# Altium schematic sheet LED4.SchDoc
size A4
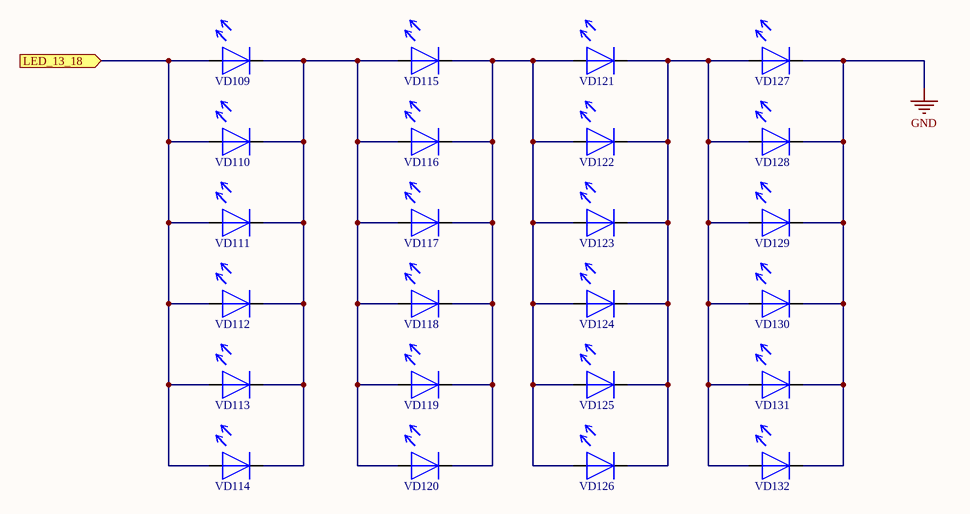
[diagram p0: LED4.SchDoc]

## Parts
VD109  SPMWHT541MD5WAT0SB  [LED_Samsung]  (value not drawn)
VD110  SPMWHT541MD5WAT0SB  [LED_Samsung]  (value not drawn)
VD111  SPMWHT541MD5WAT0SB  [LED_Samsung]  (value not drawn)
VD112  SPMWHT541MD5WAT0SB  [LED_Samsung]  (value not drawn)
VD113  SPMWHT541MD5WAT0SB  [LED_Samsung]  (value not drawn)
VD114  SPMWHT541MD5WAT0SB  [LED_Samsung]  (value not drawn)
VD115  SPMWHT541MD5WAT0SB  [LED_Samsung]  (value not drawn)
VD116  SPMWHT541MD5WAT0SB  [LED_Samsung]  (value not drawn)
VD117  SPMWHT541MD5WAT0SB  [LED_Samsung]  (value not drawn)
VD118  SPMWHT541MD5WAT0SB  [LED_Samsung]  (value not drawn)
VD119  SPMWHT541MD5WAT0SB  [LED_Samsung]  (value not drawn)
VD120  SPMWHT541MD5WAT0SB  [LED_Samsung]  (value not drawn)
VD121  SPMWHT541MD5WAT0SB  [LED_Samsung]  (value not drawn)
VD122  SPMWHT541MD5WAT0SB  [LED_Samsung]  (value not drawn)
VD123  SPMWHT541MD5WAT0SB  [LED_Samsung]  (value not drawn)
VD124  SPMWHT541MD5WAT0SB  [LED_Samsung]  (value not drawn)
VD125  SPMWHT541MD5WAT0SB  [LED_Samsung]  (value not drawn)
VD126  SPMWHT541MD5WAT0SB  [LED_Samsung]  (value not drawn)
VD127  SPMWHT541MD5WAT0SB  [LED_Samsung]  (value not drawn)
VD128  SPMWHT541MD5WAT0SB  [LED_Samsung]  (value not drawn)
VD129  SPMWHT541MD5WAT0SB  [LED_Samsung]  (value not drawn)
VD130  SPMWHT541MD5WAT0SB  [LED_Samsung]  (value not drawn)
VD131  SPMWHT541MD5WAT0SB  [LED_Samsung]  (value not drawn)
VD132  SPMWHT541MD5WAT0SB  [LED_Samsung]  (value not drawn)

## Ports
LED_13_18 (in)

## Nets
GND: VD127.2 VD128.2 VD129.2 VD130.2 VD131.2 VD132.2
LED_13_18: VD109.1 VD110.1 VD111.1 VD112.1 VD113.1 VD114.1 ; port LED_13_18
NetVD109_2: VD109.2 VD110.2 VD111.2 VD112.2 VD113.2 VD114.2 VD115.1 VD116.1 VD117.1 VD118.1 VD119.1 VD120.1
NetVD115_2: VD115.2 VD116.2 VD117.2 VD118.2 VD119.2 VD120.2 VD121.1 VD122.1 VD123.1 VD124.1 VD125.1 VD126.1
NetVD121_2: VD121.2 VD122.2 VD123.2 VD124.2 VD125.2 VD126.2 VD127.1 VD128.1 VD129.1 VD130.1 VD131.1 VD132.1

## Library data of the parts
VD109-VD132 = LED SPMWHT541MD5WAT0SB: Value: SPMWHT541MD5WAT0SB